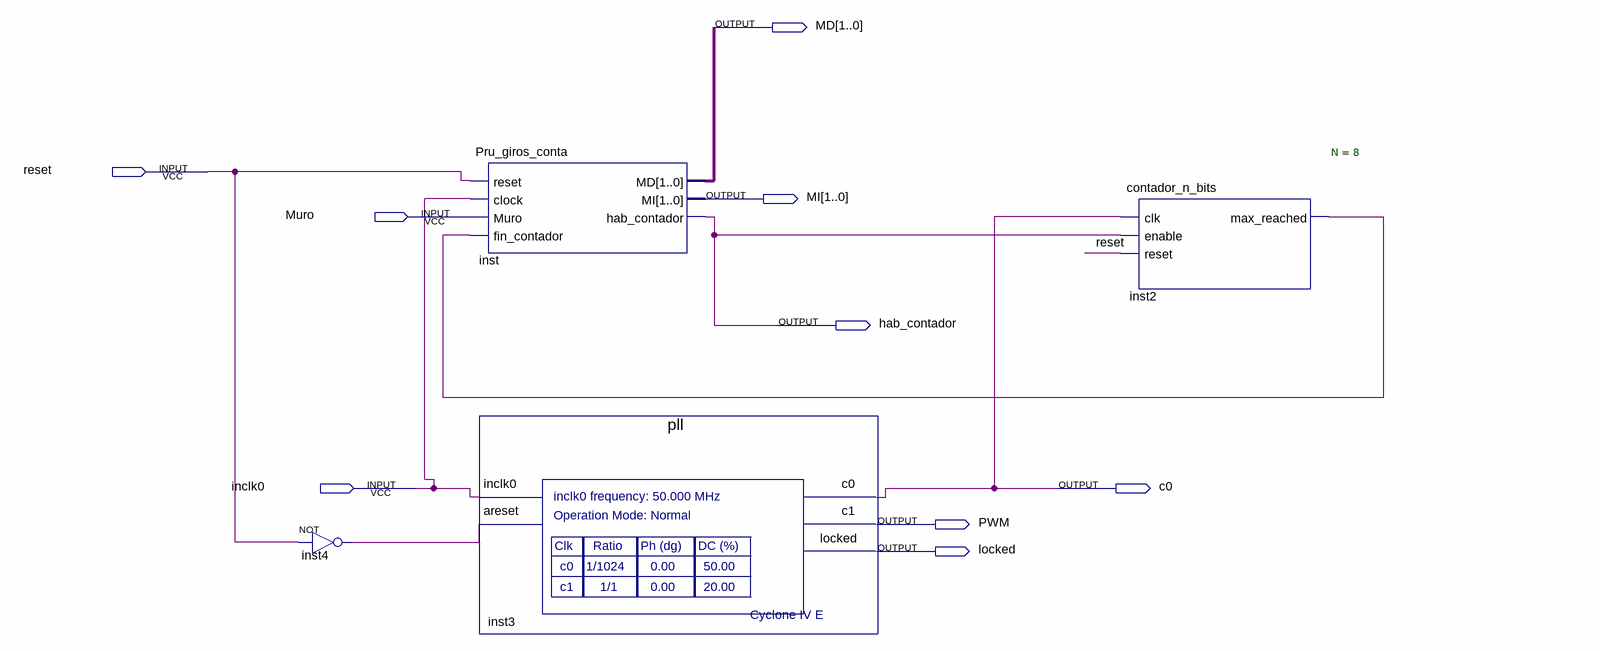
[diagram p0: schematic sheet]
// Quartus schematic control_giros_contador.bdf as structural Verilog: 4 symbols, 9 pins
module control_giros_contador (
  input  reset,
  input  Muro,
  input  inclk0,
  output [1:0] MD,
  output [1:0] MI,
  output hab_contador,
  output c0,
  output PWM,
  output locked
);

  wire inst2_max_reached, inst4_out;

  not inst4 (inst4_out, reset);
  Pru_giros_conta inst (
    .reset(reset), .clock(inclk0), .Muro(Muro), .fin_contador(inst2_max_reached), .MD(MD), .MI(MI),
    .hab_contador(hab_contador));
  pll inst3 (.inclk0(inclk0), .areset(inst4_out), .c0(c0), .c1(PWM), .locked(locked));
  contador_n_bits #(.N(8)) inst2 (.clk(c0), .enable(hab_contador), .reset(reset), .max_reached(inst2_max_reached));
endmodule
